# Altium schematic sheet Sheet1.SchDoc
size A2; SheetNumber: 1; SheetTotal: 1
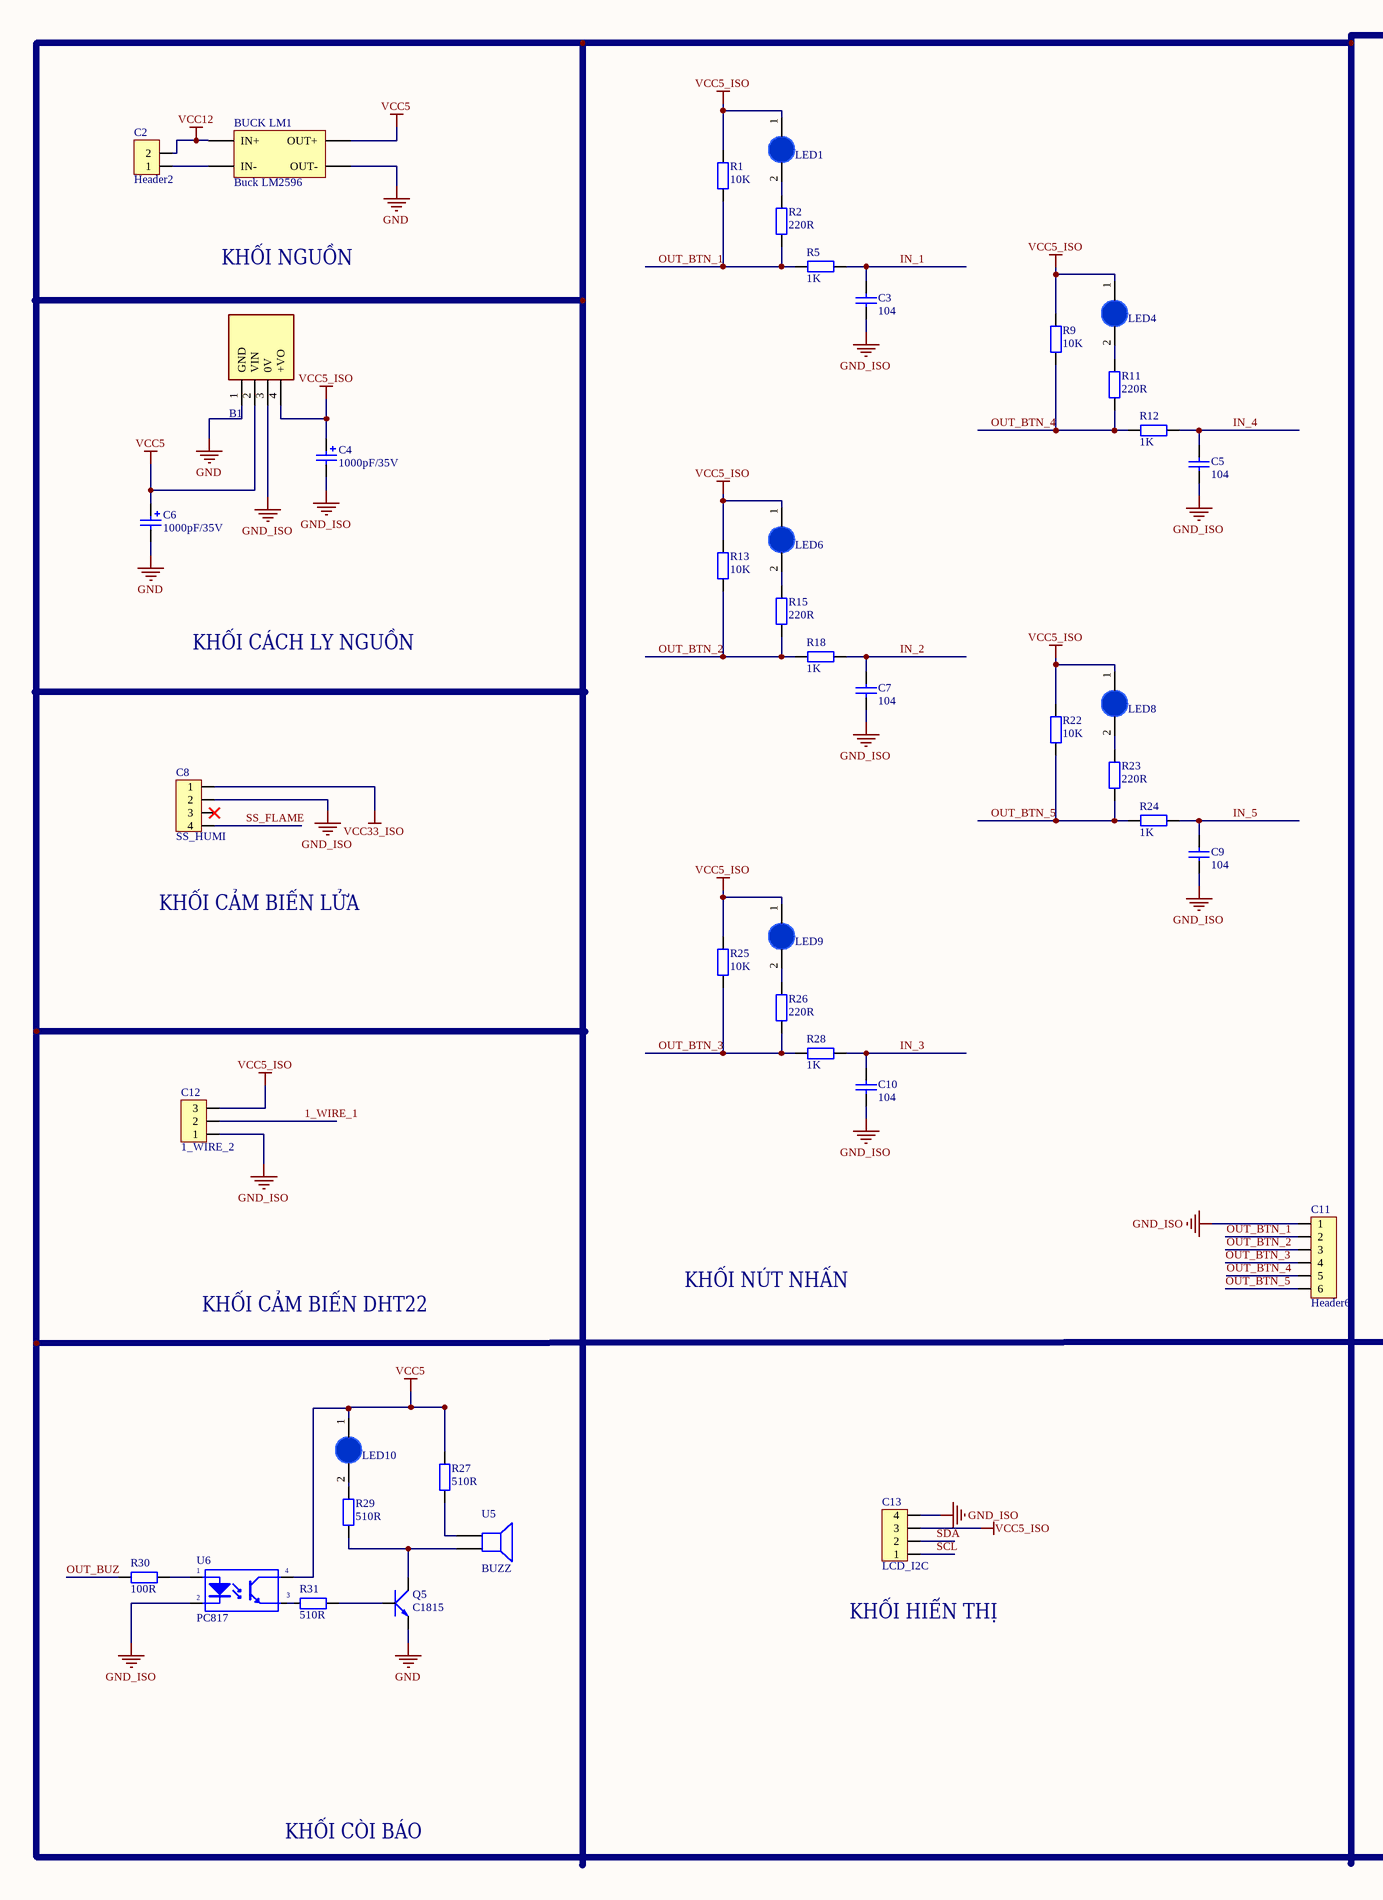
[diagram p0: Sheet1.SchDoc, left]
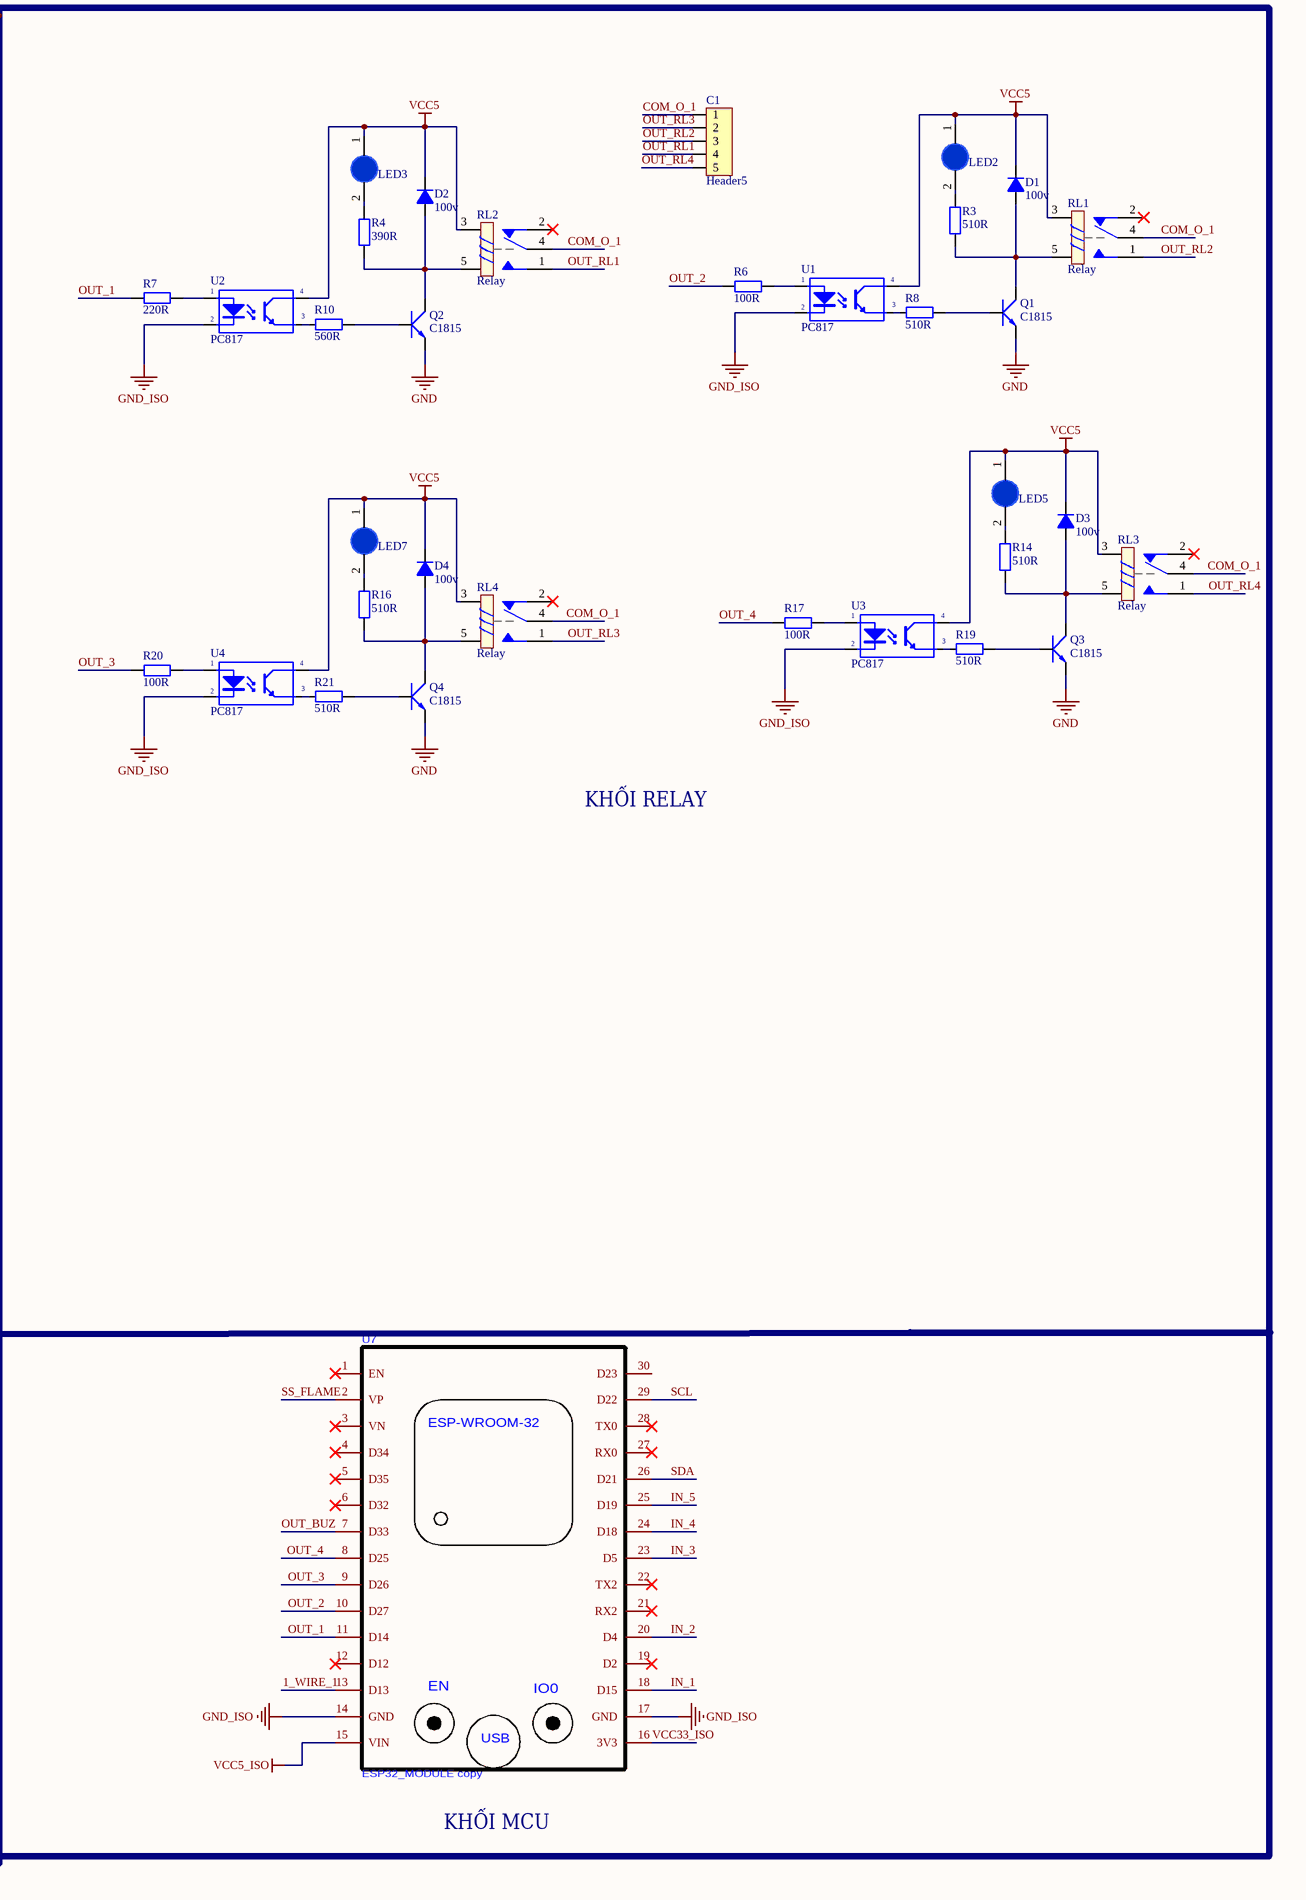
[diagram p1: Sheet1.SchDoc, right]

## Parts
B1  B0505S1W  [B0505S1W]  (value not drawn)
BUCK_LM1  Buck LM2596  [BUCK LM2596]
C1  Header5  [Header5]
C2  Header2  [Header2]
C3  104  [tu gom]
C4  value 1000pF/35V  [CP2/5]  (hidden comment: Cap Pol3)
C5  104  [tu gom]
C6  value 1000pF/35V  [CP2/5]  (hidden comment: Cap Pol3)
C7  104  [tu gom]
C8  SS_HUMI  [Header4]
C9  104  [tu gom]
C10  104  [tu gom]
C11  Header6  [HDR6]
C12  1_WIRE_2  [Header3]
C13  LCD_I2C  [Header4]
D1  100v  [DIODE 0.5A]
D2  100v  [DIODE 0.5A]
D3  100v  [DIODE 0.5A]
D4  100v  [DIODE 0.5A]
LED1  LED 3mm  [LED-3MM-BLUE]  (value not drawn)
LED2  LED 3mm  [LED-3MM-BLUE]  (value not drawn)
LED3  LED 3mm  [LED-3MM-BLUE]  (value not drawn)
LED4  LED 3mm  [LED-3MM-BLUE]  (value not drawn)
LED5  LED 3mm  [LED-3MM-BLUE]  (value not drawn)
LED6  LED 3mm  [LED-3MM-BLUE]  (value not drawn)
LED7  LED 3mm  [LED-3MM-BLUE]  (value not drawn)
LED8  LED 3mm  [LED-3MM-BLUE]  (value not drawn)
LED9  LED 3mm  [LED-3MM-BLUE]  (value not drawn)
LED10  LED 3mm  [LED-3MM-BLUE]  (value not drawn)
Q1  C1815  [C1815_cam]
Q2  C1815  [C1815_cam]
Q3  C1815  [C1815_cam]
Q4  C1815  [C1815_cam]
Q5  C1815  [C1815_cam]
R1  10K  [R1/4W]
R2  220R  [R1/4W]
R3  510R  [R1/4W]
R4  390R  [R1/4W]
R5  1K  [R1/4W]
R6  100R  [R1/4W]
R7  220R  [R1/4W]
R8  510R  [R1/4W]
R9  10K  [R1/4W]
R10  560R  [R1/4W]
R11  220R  [R1/4W]
R12  1K  [R1/4W]
R13  10K  [R1/4W]
R14  510R  [R1/4W]
R15  220R  [R1/4W]
R16  510R  [R1/4W]
R17  100R  [R1/4W]
R18  1K  [R1/4W]
R19  510R  [R1/4W]
R20  100R  [R1/4W]
R21  510R  [R1/4W]
R22  10K  [R1/4W]
R23  220R  [R1/4W]
R24  1K  [R1/4W]
R25  10K  [R1/4W]
R26  220R  [R1/4W]
R27  510R  [R1/4W]
R28  1K  [R1/4W]
R29  510R  [R1/4W]
R30  100R  [R1/4W]
R31  510R  [R1/4W]
RL1  Relay  [RELAY_SRA_05VDC_SL_C]
RL2  Relay  [RELAY_SRA_05VDC_SL_C]
RL3  Relay  [RELAY_SRA_05VDC_SL_C]
RL4  Relay  [RELAY_SRA_05VDC_SL_C]
U1  PC817  [DIP4/W0.3]
U2  PC817  [DIP4/W0.3]
U3  PC817  [DIP4/W0.3]
U4  PC817  [DIP4/W0.3]
U5  BUZZ  [BUZZER_D9_TH]
U6  PC817  [DIP4/W0.3]
U7  ESP32_MODULE copy  [ESP32-WIFIMODULE-FOOTPRINT]

## Nets
GND: B1.1(GND) BUCK_LM1.3(OUT-) C6.2 Q1.1(E) Q2.1(E) Q3.1(E) Q4.1(E) Q5.1(E)
GND_ISO: B1.3(0V) C3.2 C4.2 C5.2 C7.2 C8.2 C9.2 C10.2 C11.1 C12.1 C13.4 U1.2(K) U2.2(K) U3.2(K) U4.2(K) U6.2(K) U7.14(GND) U7.17(GND)
VCC5: B1.2(VIN) BUCK_LM1.4(OUT+) C6.1 D1.2(K) D2.2(K) D3.2(K) D4.2(K) LED2.1(A) LED3.1(A) LED5.1(A) LED7.1(A) LED10.1(A) R27.1 RL1.3 RL2.3 RL3.3 RL4.3 U1.4(C) U2.4(C) U3.4(C) U4.4(C) U6.4(C)
VCC5_ISO: B1.4(+VO) C4.1 C12.3 C13.3 LED1.1(A) LED4.1(A) LED6.1(A) LED8.1(A) LED9.1(A) R1.2 R9.2 R13.2 R22.2 R25.2 U7.15(VIN)
VCC12: BUCK_LM1.1(IN+) C2.2
VCC33_ISO: C8.1 U7.16(3V3)
1_WIRE_1: C12.2 U7.13(D13)
COM_O_1: C1.1 RL1.4 RL2.4 RL3.4 RL4.4
IN_1: C3.1 R5.1 U7.18(D15)
IN_2: C7.1 R18.1 U7.20(D4)
IN_3: C10.1 R28.1 U7.23(D5)
IN_4: C5.1 R12.1 U7.24(D18)
IN_5: C9.1 R24.1 U7.25(D19)
OUT_1: R7.1 U7.11(D14)
OUT_2: R6.1 U7.10(D27)
OUT_3: R20.1 U7.9(D26)
OUT_4: R17.1 U7.8(D25)
OUT_BTN_1: C11.2 R1.1 R2.1 R5.2
OUT_BTN_2: C11.3 R13.1 R15.1 R18.2
OUT_BTN_3: C11.4 R25.1 R26.1 R28.2
OUT_BTN_4: C11.5 R9.1 R11.1 R12.2
OUT_BTN_5: C11.6 R22.1 R23.1 R24.2
OUT_BUZ: R30.1 U7.7(D33)
OUT_RL1: C1.4 RL2.1
OUT_RL2: C1.3 RL1.1
OUT_RL3: C1.2 RL4.1
OUT_RL4: C1.5 RL3.1
SCL: C13.1 U7.29(D22)
SDA: C13.2 U7.26(D21)
SS_FLAME: C8.4 U7.2(VP)
NetBUCK_LM1_2: BUCK_LM1.2(IN-) C2.1
NetD1_1: D1.1(A) Q1.2(C) R3.2 RL1.5
NetD2_1: D2.1(A) Q2.2(C) R4.2 RL2.5
NetD3_1: D3.1(A) Q3.2(C) R14.2 RL3.5
NetD4_1: D4.1(A) Q4.2(C) R16.2 RL4.5
NetLED1_2: LED1.2(K) R2.2
NetLED2_2: LED2.2(K) R3.1
NetLED3_2: LED3.2(K) R4.1
NetLED4_2: LED4.2(K) R11.2
NetLED5_2: LED5.2(K) R14.1
NetLED6_2: LED6.2(K) R15.2
NetLED7_2: LED7.2(K) R16.1
NetLED8_2: LED8.2(K) R23.2
NetLED9_2: LED9.2(K) R26.2
NetLED10_2: LED10.2(K) R29.1
NetQ1_3: Q1.3(B) R8.2
NetQ2_3: Q2.3(B) R10.2
NetQ3_3: Q3.3(B) R19.2
NetQ4_3: Q4.3(B) R21.2
NetQ5_2: Q5.2(C) R29.2 U5.2
NetQ5_3: Q5.3(B) R31.2
NetR6_2: R6.2 U1.1(A)
NetR7_2: R7.2 U2.1(A)
NetR8_1: R8.1 U1.3(E)
NetR10_1: R10.1 U2.3(E)
NetR17_2: R17.2 U3.1(A)
NetR19_1: R19.1 U3.3(E)
NetR20_2: R20.2 U4.1(A)
NetR21_1: R21.1 U4.3(E)
NetR27_2: R27.2 U5.1
NetR30_2: R30.2 U6.1(A)
NetR31_1: R31.1 U6.3(E)

Not connected (* = marked no-connect by the designer): C8 3*; RL1 2*; RL2 2*; RL3 2*; RL4 2*; U7 1(EN)* 3(VN)* 4(D34)* 5(D35)* 6(D32)* 12(D12)* 19(D2)* 21(RX2)* 22(TX2)* 27(RX0)* 28(TX0)* 30(D23)

## Notes on the sheet
- KHỐI NGUỒN
- KHỐI CÁCH LY NGUỒN
- KHỐI RELAY
- KHỐI CẢM BIẾN LỬA
- KHỐI NÚT NHẤN
- KHỐI CẢM BIẾN DHT22
- (near C13) KHỐI HIỂN THỊ
- KHỐI CÒI BÁO
- KHỐI MCU
- (in symbol ESP32_MODULE copy) ESP-WROOM-32; IO0; USB

## Library data of the parts
B1 = B0505S1W: Power Supply; Manufacturer_Name: Mornsun; Manufacturer_Part_Number: B0505S-1W; Datasheet Link: https://www.mornsun-power.com/uploads/pdf/B_D-1W.pdf; Height: 10.41mm
C1 = Header5: Header IDC, 5 x 1 Pin Vertical 2.54mm Pitch (Non-Boxed, Male); Manufacturer: W¨¹rth Elektronik eiSos GmbH; partNo: 613002143121; ComponentLink1 Description: Manufacturer; ComponentLink2 Description: Datasheet; NoPins: 02; Created Date: 29 March 2013; ComponentLink1URL: http://www.we-online.com; ComponentLink2URL: http://katalog.we-online.de/em/datasheet/6130xx143121.pdf; Created by: Karrer Zheng
C2 = Header2: Header IDC, 2 x 1 Pin Vertical 2.54mm Pitch (Non-Boxed, Male); Manufacturer: W¨¹rth Elektronik eiSos GmbH; partNo: 613002143121; ComponentLink1 Description: Manufacturer; ComponentLink2 Description: Datasheet; NoPins: 02; Created Date: 29 March 2013; ComponentLink1URL: http://www.we-online.com; ComponentLink2URL: http://katalog.we-online.de/em/datasheet/6130xx143121.pdf; Created by: Karrer Zheng
C3 C5 C7 C9 C10 = Tu gom 104 50V: Cắm; So_Chan: 2; Ten_Linh_Kien: Tụ gốm 104 100nF 50V; Don_Vi: Con; Ma_Hang: MH004761; Chung_Loai: Cắm; Kieu_Chan: *
C4 C6 = Cap Pol3: Polarized Capacitor (Surface Mount); VALUE: C?; LatestRevisionDate: 17-Jul-2002; LatestRevisionNote: Re-released for DXP Platform.; PackageReference: C0805; Publisher: Altium Limited
C8 C13 = Header4: Header IDC, 4 x 1 Pin Vertical 2.54mm Pitch (Non-Boxed, Male); Manufacturer: W¨¹rth Elektronik eiSos GmbH; partNo: 613002143121; ComponentLink1 Description: Manufacturer; ComponentLink2 Description: Datasheet; NoPins: 02; Created Date: 29 March 2013; ComponentLink1URL: http://www.we-online.com; ComponentLink2URL: http://katalog.we-online.de/em/datasheet/6130xx143121.pdf; Created by: Karrer Zheng
C11 = Header6: Header IDC, 6 x 1 Pin Vertical 2.54mm Pitch (Non-Boxed, Male); Manufacturer: W¨¹rth Elektronik eiSos GmbH; partNo: 613002143121; ComponentLink1 Description: Manufacturer; ComponentLink2 Description: Datasheet; NoPins: 02; Created Date: 29 March 2013; ComponentLink1URL: http://www.we-online.com; ComponentLink2URL: http://katalog.we-online.de/em/datasheet/6130xx143121.pdf; Created by: Karrer Zheng
C12 = Header3: Header IDC, 3 x 1 Pin Vertical 2.54mm Pitch (Non-Boxed, Male); Manufacturer: W¨¹rth Elektronik eiSos GmbH; partNo: 613002143121; ComponentLink1 Description: Manufacturer; ComponentLink2 Description: Datasheet; NoPins: 02; Created Date: 29 March 2013; ComponentLink1URL: http://www.we-online.com; ComponentLink2URL: http://katalog.we-online.de/em/datasheet/6130xx143121.pdf; Created by: Karrer Zheng
D1-D4 = Diode 1N4148: Cắm; Ten_Linh_Kien: Diode 1N4148 DO35 450mA 100V ( 1N4148 DIP); Don_Vi: Con; Ma_Hang: MH001065; Ghi Chu: *; Kieu_Chan: *; Chung_Loai: Cắm
LED1-LED10 = LED 3mm Xanh Duong: Cắm; Don_Vi: Con; Ma_Hang: MH009003; Ten_Linh_Kien: LED 3MM Xanh Dương SS (1000c); Ghi_Chu: *; Kieu_Chan: *; Chung_Loai: Cắm
Q1-Q5 = C1815: NPN 600mW, ECB; Value: C1815
R1-R31 = R1/4W: Resistor 1/4W; Value: R1/4W - 1K
RL1-RL4 = RL_SRA-05VDC-SL-C: Relay 5 Chan; Ma_Hang: MH009374; Ten: Relay 5V10A SRD-05VDC-SL-C Chính Hãng
U1-U4 U6 = PC817: Single Opto; Value: PC817
U5 = Speaker: Loudspeaker